# EAGLE schematic LCD Harness (EAGLE 6.5.0)
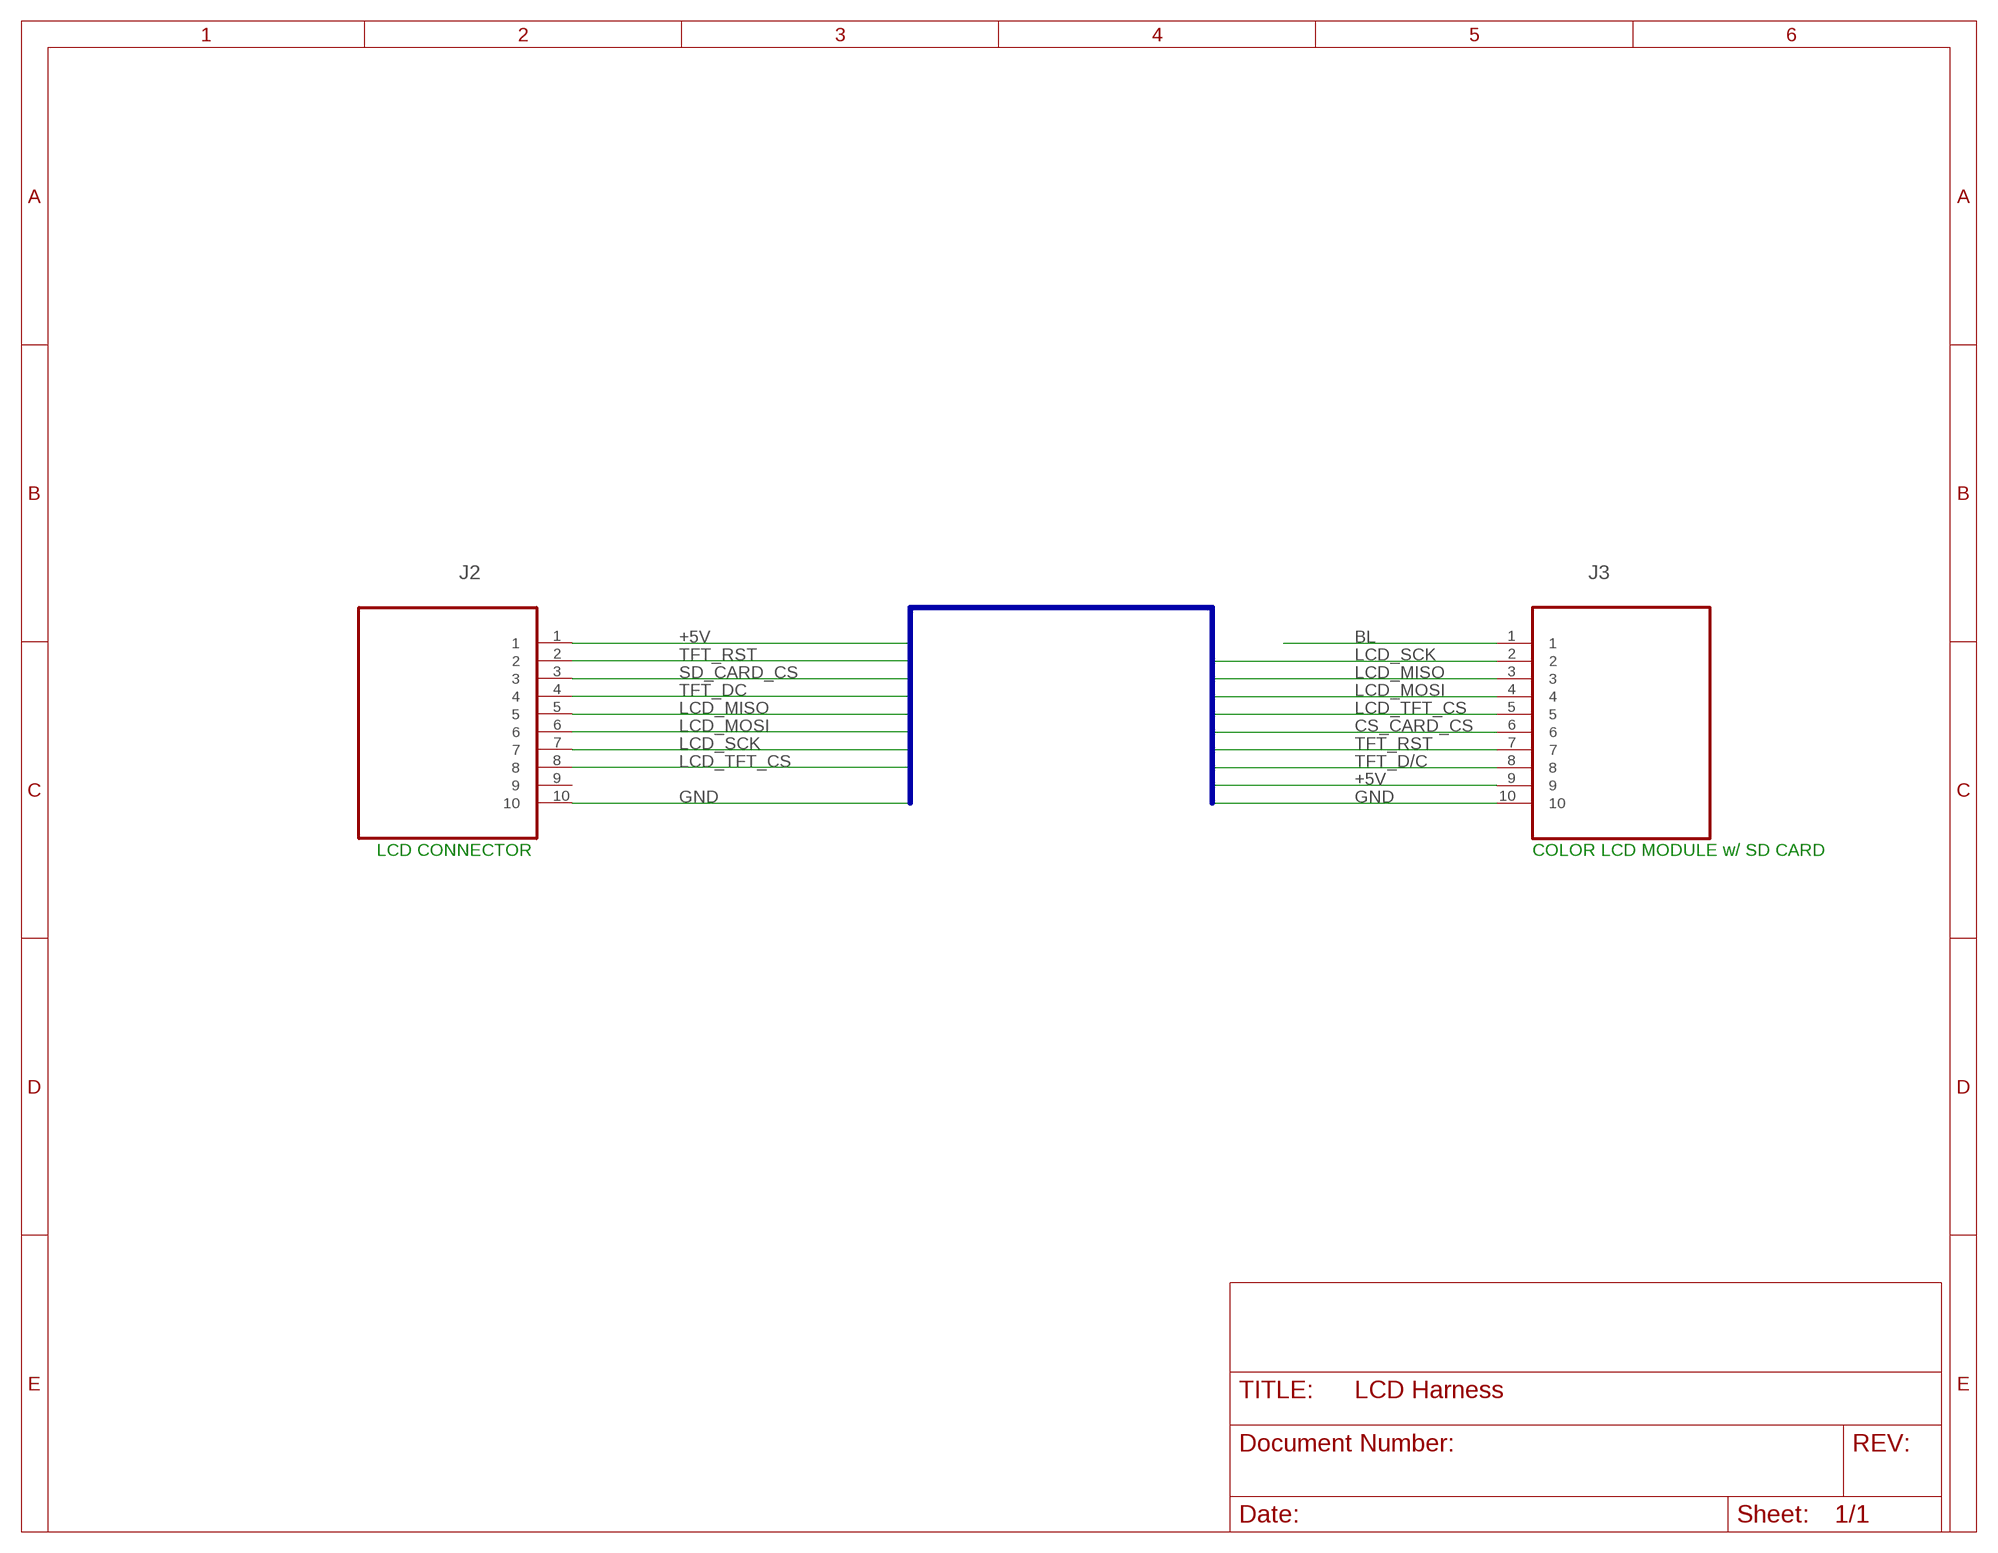
[diagram p0: schematic, sheet 1]

## Parts
J2  TSW-110-08-L-S-RA  [SAMTEC_TSW-110-08-L-S-RA]
J3  TSW-110-08-L-S-RA  [SAMTEC_TSW-110-08-L-S-RA]

## Nets
+5V: J2.1
B$1: J3.9
BL: J3.1
CS_CARD_CS: J3.6
GND: J2.10 J3.10
LCD_MISO: J2.5 J3.3
LCD_MOSI: J2.6 J3.4
LCD_SCK: J2.7
LCD_TFT_CS: J2.8
N$2: J3.2
N$5: J3.5
SD_CARD_CS: J2.3
TFT_D/C: J3.8
TFT_DC: J2.4
TFT_RST: J2.2 J3.7
Unconnected: J2.9

## Buses
B$1

## Notes on the sheet
- LCD CONNECTOR | COLOR LCD MODULE w/ SD CARD

## Library data of the parts
J2 J3 = SAMTEC_TSW-XXX-S-X_By_element14_Batch_1:TSW-110-08-L-S-RA: CONN HEADER, 2.54MM, THT, R/A, 10WAY; MPN: TSW-110-08-L-S-RA; OC_FARNELL: 2041530; OC_NEWARK: 12P1805; PACKAGE: HEADER, 2.54MM, THT, R/A, 10WAY; SUPPLIER: Samtec